# EAGLE design 503_outin_ichigojam (EAGLE 9.6.2)
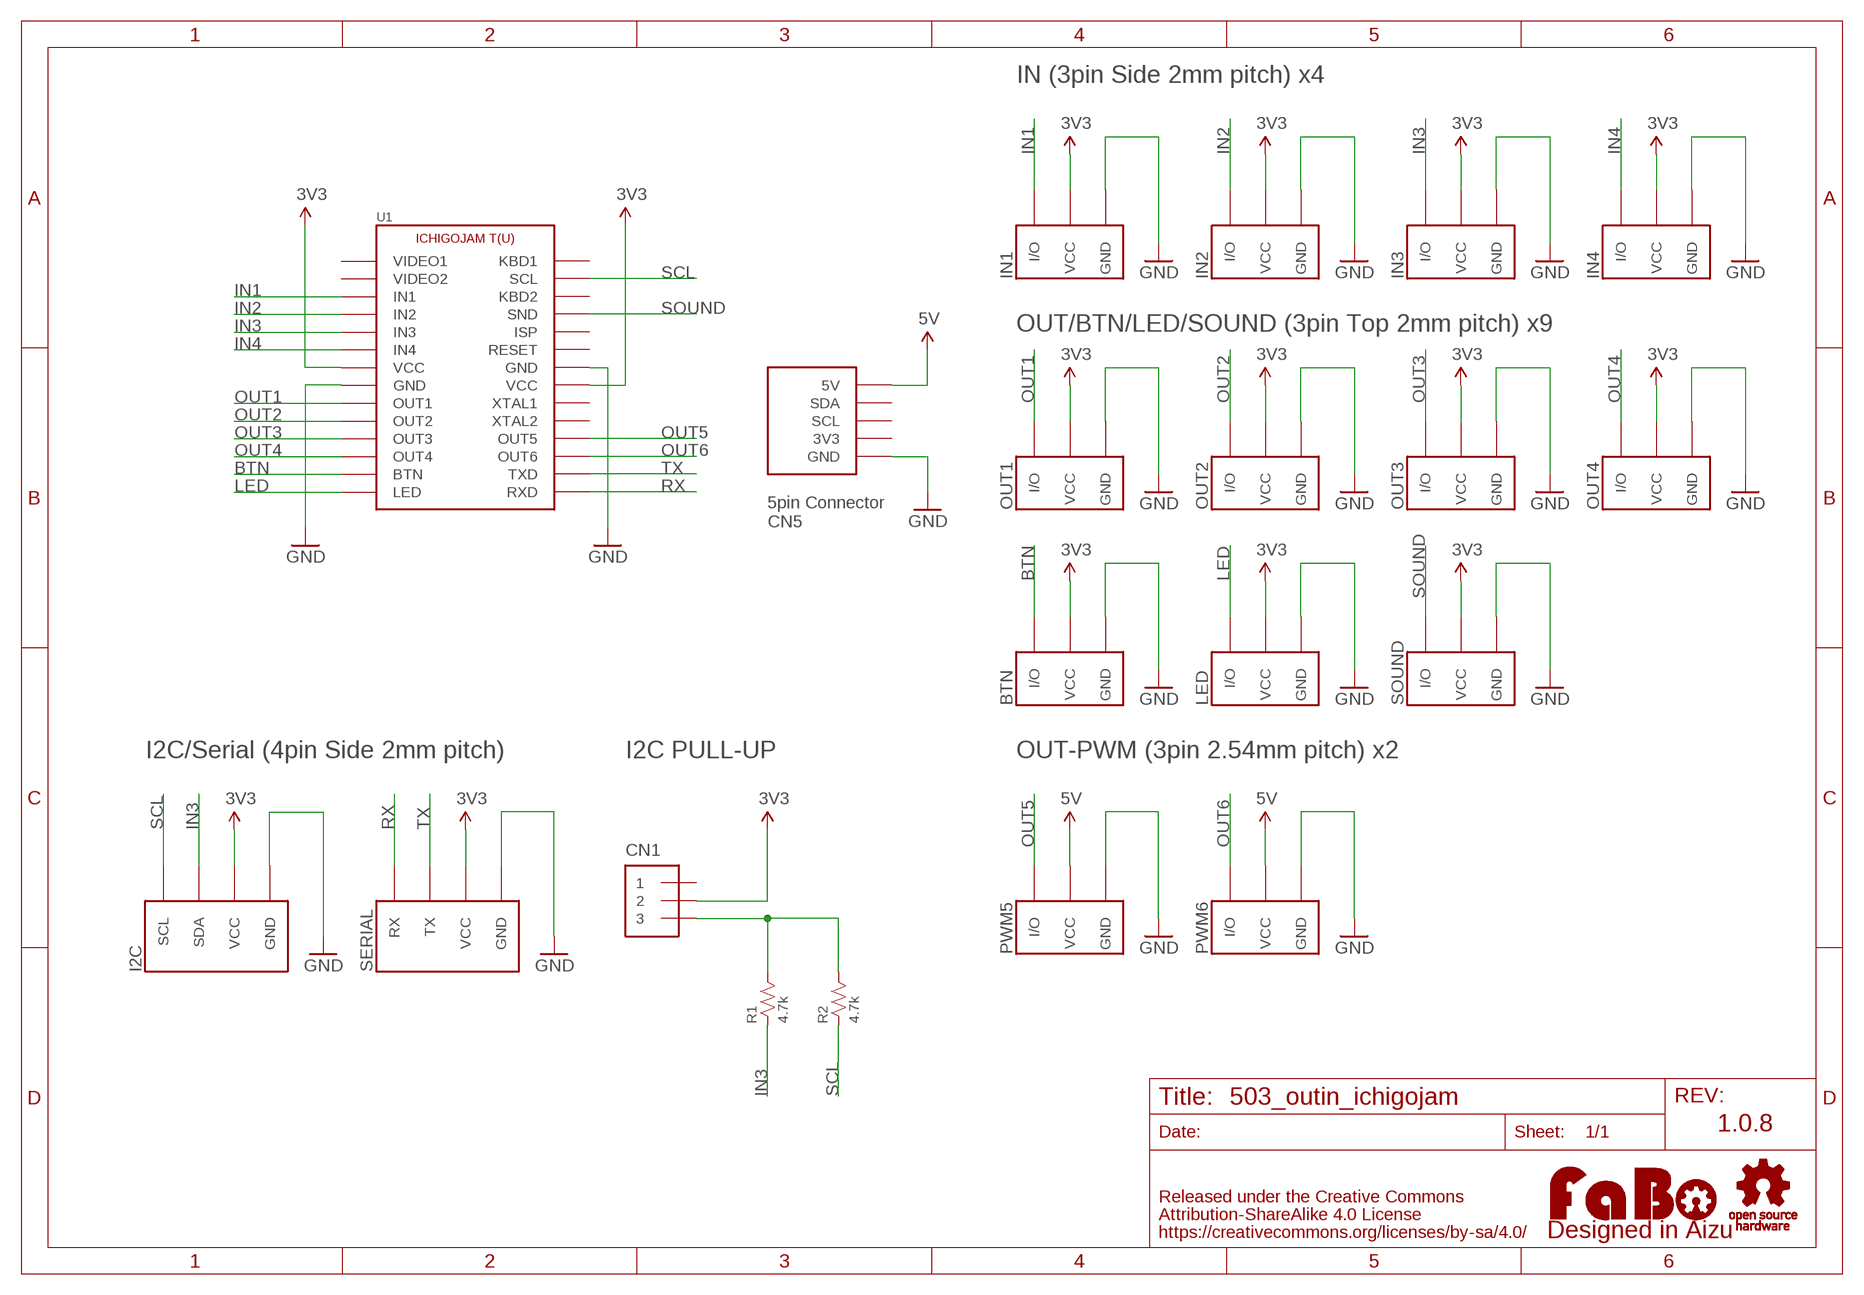
[diagram p0: schematic, sheet 1]

## Parts
BTN  FABO_BRICK_3PIN-B03B-PASK-1  [FABO_BRICK_3PIN_B03B-PASK-1]
CN1  PIN_HEADER_1X3  [PIN_1X3]
I2C  FABO_BRICK_I2C-S04B-PASK-2_LONG  [FABO_BRICK_I2C_S04B-PASK-2_LONG]
IN1  FABO_BRICK_3PIN-S03B-PASK-2_LONG  [FABO_BRICK_3PIN_S03B-PASK-2_LONG]
IN2  FABO_BRICK_3PIN-S03B-PASK-2_LONG  [FABO_BRICK_3PIN_S03B-PASK-2_LONG]
IN3  FABO_BRICK_3PIN-S03B-PASK-2_LONG  [FABO_BRICK_3PIN_S03B-PASK-2_LONG]
IN4  FABO_BRICK_3PIN-S03B-PASK-2_LONG  [FABO_BRICK_3PIN_S03B-PASK-2_LONG]
LED  FABO_BRICK_3PIN-B03B-PASK-1  [FABO_BRICK_3PIN_B03B-PASK-1]
LOGO1  LOGO_FABO-M  [LOGO_FABO_M]
OUT1  FABO_BRICK_3PIN-B03B-PASK-1  [FABO_BRICK_3PIN_B03B-PASK-1]
OUT2  FABO_BRICK_3PIN-B03B-PASK-1  [FABO_BRICK_3PIN_B03B-PASK-1]
OUT3  FABO_BRICK_3PIN-B03B-PASK-1  [FABO_BRICK_3PIN_B03B-PASK-1]
OUT4  FABO_BRICK_3PIN-B03B-PASK-1  [FABO_BRICK_3PIN_B03B-PASK-1]
PWM5  FABO_BRICK_3PIN-HEADER  [FABO_BRICK_3PIN_HEADER]
PWM6  FABO_BRICK_3PIN-HEADER  [FABO_BRICK_3PIN_HEADER]
R1  4.7k  RESISTOR-AXL-REGULAR  [AXL-REGULAR]
R2  4.7k  RESISTOR-AXL-REGULAR  [AXL-REGULAR]
SERIAL  FABO_BRICK_SERIAL-S04B-PASK-2_LONG  [FABO_BRICK_SERIAL_S04B-PASK-2_LONG]
SOUND  FABO_BRICK_3PIN-B03B-PASK-1  [FABO_BRICK_3PIN_B03B-PASK-1]
U1  ICHIGOJAM_T-NOLABEL  [ICHIGOJAM_T_NOLABEL]
U$2  LOGO_OSHW-M_BOTTOM  [LOGO_OSHW_M_BOTTOM]

## Nets
3V3: BTN.VCC CN1.2 I2C.VCC IN1.VCC IN2.VCC IN3.VCC IN4.VCC LED.VCC OUT1.VCC OUT2.VCC OUT3.VCC OUT4.VCC SERIAL.VCC SOUND.VCC U1.VCC1(VCC) U1.VCC2(VCC)
5V: PWM5.VCC PWM6.VCC U1.5V
BTN: BTN.I/O U1.BTN
GND: BTN.GND I2C.GND IN1.GND IN2.GND IN3.GND IN4.GND LED.GND OUT1.GND OUT2.GND OUT3.GND OUT4.GND PWM5.GND PWM6.GND SERIAL.GND SOUND.GND U1.GND1(GND) U1.GND2(GND) U1.GND3(GND)
IN1: IN1.I/O U1.IN1
IN2: IN2.I/O U1.IN2
IN3: I2C.SDA IN3.I/O R1.1 U1.IN3
IN4: IN4.I/O U1.IN4
LED: LED.I/O U1.LED
N$1: CN1.3 R1.2 R2.2
OUT1: OUT1.I/O U1.OUT1
OUT2: OUT2.I/O U1.OUT2
OUT3: OUT3.I/O U1.OUT3
OUT4: OUT4.I/O U1.OUT4
OUT5: PWM5.I/O U1.OUT5
OUT6: PWM6.I/O U1.OUT6
RX: SERIAL.RX U1.RXD
SCL: I2C.SCL R2.1 U1.SCL1(SCL)
SOUND: SOUND.I/O U1.SND
TX: SERIAL.TX U1.TXD
Unconnected: CN1.1 U1.3V3 U1.ISP U1.KBD1 U1.KBD2 U1.RST(RESET) U1.SCL2(SCL) U1.SDA U1.VIDEO1 U1.VIDEO2 U1.XTAL1 U1.XTAL2

## Notes on the sheet
- IN (3pin Side 2mm pitch) x4
- OUT/BTN/LED/SOUND (3pin Top 2mm pitch) x9
- 5pin Connector
  CN5
- I2C/Serial (4pin Side 2mm pitch) | I2C PULL-UP | OUT-PWM (3pin 2.54mm pitch) x2
- 1.0.8

## Library data of the parts
BTN IN1-IN4 LED OUT1-OUT4 PWM5 PWM6 SOUND = FaBo-Template:FABO_BRICK_3PIN: FaBo Brick 3pin
CN1 = FaBo-PIN:PIN_HEADER_1X3
I2C = FaBo-Template:FABO_BRICK_I2C: FaBo Brick I2C
LOGO1 = component:LOGO_FABO
R1 R2 = FaBo-Resistors:RESISTOR: RESISTOR
SERIAL = FaBo-Template:FABO_BRICK_SERIAL: FaBo Brick Serial
U1 = FaBo-Boards:ICHIGOJAM_T
U$2 = FaBo-etc:LOGO_OSHW

## Board
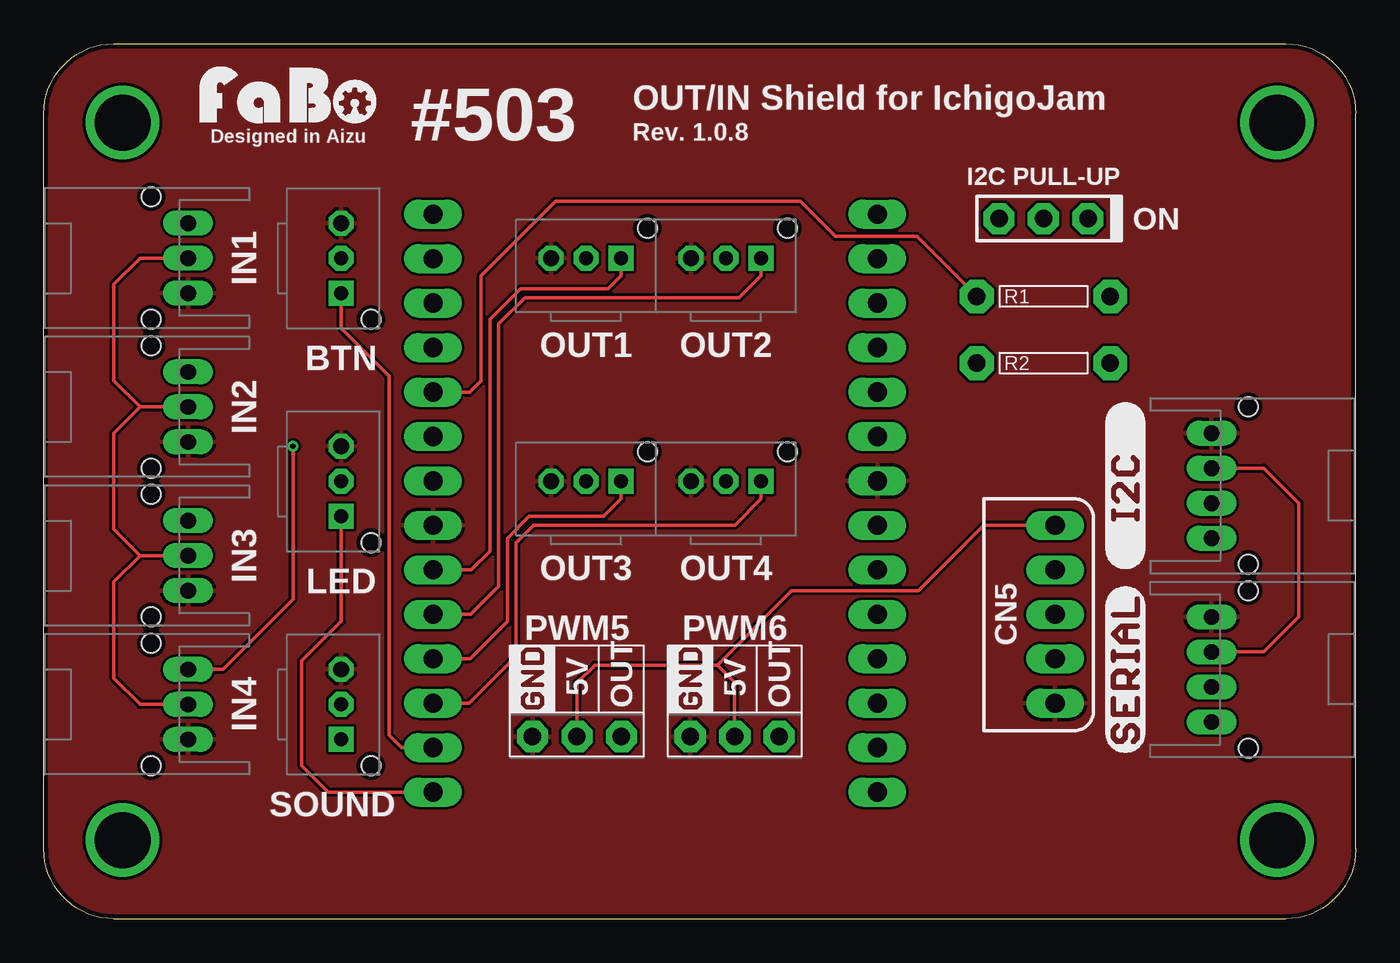
[diagram p1: board, top side]
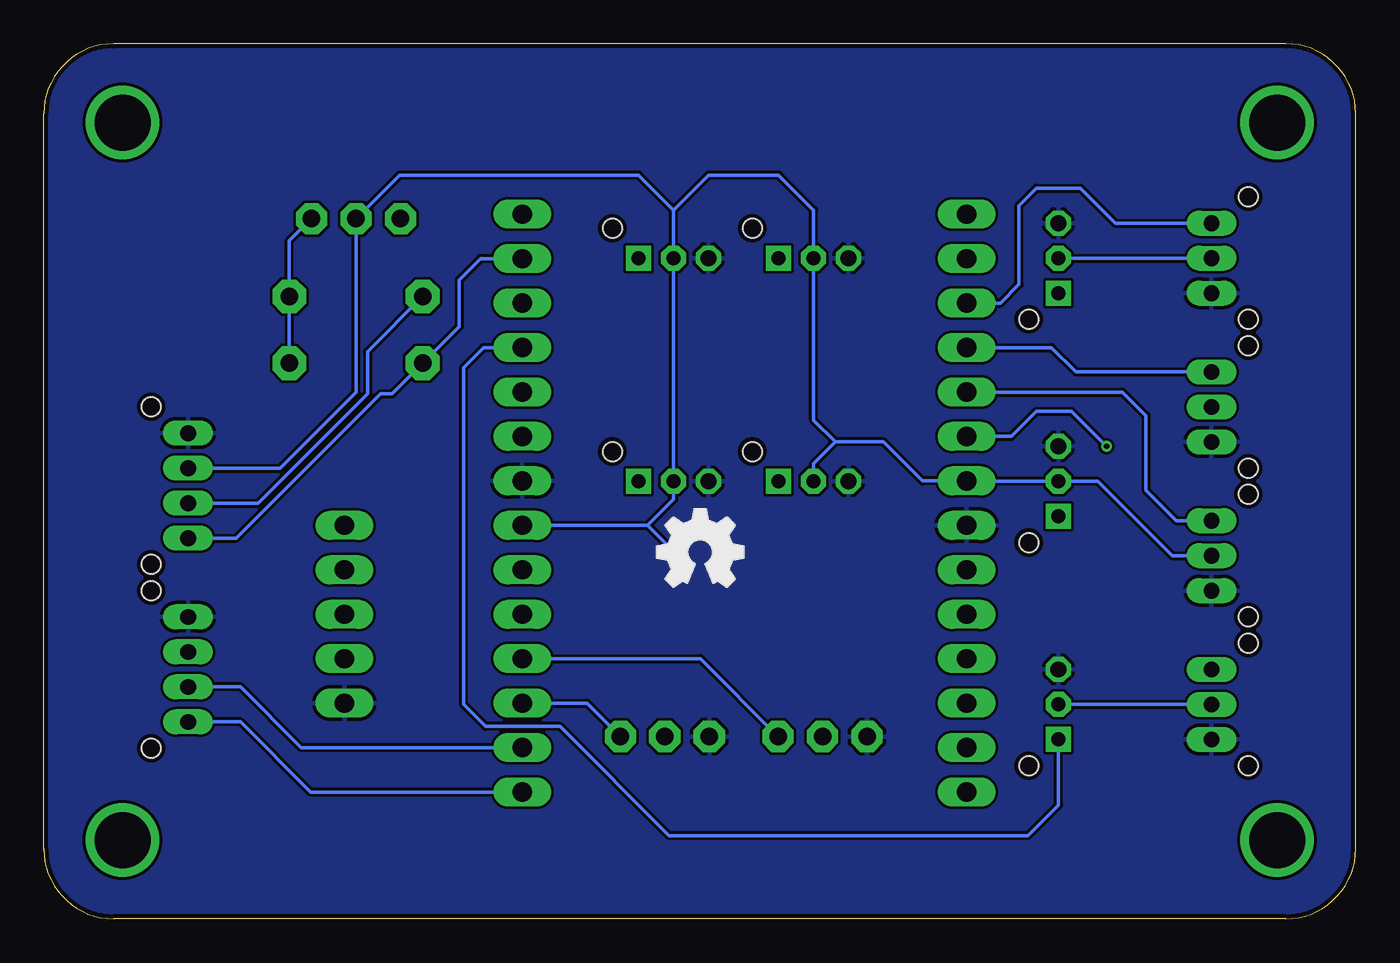
[diagram p2: board, bottom side, seen from below]

Size 75 x 50 mm. Coordinates in mm from the lower left corner, seen from the top.
Copper layers (1*16): Top 0.035mm / dielectric 1.6mm / Bottom 0.035mm
Design rules "PCBway": minimum track width 6mil, minimum drill 12mil, track to track 6mil, track to pad 6mil, pad to pad 6mil, via to via 6mil, smd to smd 6mil, copper to edge 10mil, drill to drill 10mil, minimum pad ring 10mil, minimum via ring 6mil, stop-mask expansion 2mil, vias tented up to drill 100mil, thermal gap 8mil

### Footprints (pad centres in the part's own frame; a part is rotated, then mirrored left to right if it is on the bottom)
FABO_BRICK_3PIN_B03B-PASK-1 = drill 0.9 pad 1.422 octagon: GND -2,0 | drill 0.8 pad 1.422 square: I/O 2,0 | drill 0.8 pad 1.422 octagon: VCC 0,0 | hole 1.1: 3.5,1.7
PIN_1X3 = drill 1 pad 1.778 octagon: 1 -2.54,0; 2 0,0; 3 2.54,0
FABO_BRICK_I2C_S04B-PASK-2_LONG = drill 0.9 pad 1.422 long: GND -3,0; SCL 3,0; SDA 1,0; VCC -1,0 | hole 1.1: 4.5,2.1; -4.5,2.1
FABO_BRICK_3PIN_S03B-PASK-2_LONG = drill 0.9 pad 1.422 long: GND -2,0; I/O 2,0; VCC 0,0 | hole 1.1: 3.5,2.1; -3.5,2.1
FABO_BRICK_3PIN_HEADER = drill 1 pad 1.778 octagon: GND -2.54,0; I/O 2.54,0; VCC 0,0
AXL-REGULAR = drill 1 pad 1.93 octagon: 1 -3.81,0; 2 3.81,0
FABO_BRICK_SERIAL_S04B-PASK-2_LONG = drill 0.9 pad 1.422 long: GND -3,0; RX 3,0; TX 1,0; VCC -1,0 | hole 1.1: 4.5,2.1; -4.5,2.1
ICHIGOJAM_T_NOLABEL = drill 1.1 long: 3V3 57.81,14.86; 5V 57.81,22.48; BTN 22.25,9.78; GND1 22.25,22.48; GND2 47.65,25.02; GND3 57.81,12.32; IN1 22.25,35.18; IN2 22.25,32.64; IN3 22.25,30.1; IN4 22.25,27.56; ISP 47.65,30.1; KBD1 47.65,40.26; KBD2 47.65,35.18; LED 22.25,7.24; OUT1 22.25,19.94; OUT2 22.25,17.4; OUT3 22.25,14.86; OUT4 22.25,12.32; OUT5 47.65,14.86; OUT6 47.65,12.32; RST 47.65,27.56; RXD 47.65,7.24; SCL1 47.65,37.72; SCL2 57.81,17.4; SDA 57.81,19.94; SND 47.65,32.64; TXD 47.65,9.78; VCC1 22.25,25.02; VCC2 47.65,22.48; VIDEO1 22.25,40.26; VIDEO2 22.25,37.72; XTAL1 47.65,19.94; XTAL2 47.65,17.4 | drill 3.2: P$1 4.5,45.5; P$2 70.5,45.5; P$3 70.5,4.5; P$4 4.5,4.5

### Placement (x,y rotation side)
BTN  17,37.75 270 top
CN1  57.15,40.01 0 top
I2C  66.75,24.75 270 top
IN1  8.25,37.75 90 top
IN2  8.25,29.25 90 top
IN3  8.25,20.75 90 top
IN4  8.25,12.25 90 top
LED  17,25 270 top
LOGO1  13.97,45.09 0 top
OUT1  31,37.75 0 top
OUT2  39,37.75 0 top
OUT3  31,25 0 top
OUT4  39,25 0 top
PWM5  30.48,10.41 0 top
PWM6  39.5,10.41 0 top
R1  57.15,35.56 0 top
R2  57.15,31.75 0 top
SERIAL  66.75,14.25 270 top
SOUND  17,12.25 270 top
U1  0,0 0 top
U$2  37.47,20.95 0 top
U$4  [LOGO_SILK_I2C]  63,24.75 90 top
U$5  [LOGO_SILK_SERIAL2]  63,14.25 90 top
U$7  [LOGO_SILK_GND]  29.21,11.81 90 top
U$8  [LOGO_SILK_GND]  38.23,11.81 90 top

### Tracks (layer width: path | path; a pad name or v marks a point on that pad's centre or on a via)
3V3
  Top 0.203: IN1.VCC 5.5,37.75 4,36.25 4,30.75 5.5,29.25 | 5.5,29.25 IN2.VCC | IN3.VCC 5.5,20.75 | 5.5,20.75 4,22.25 4,27.75 5.5,29.25 | IN4.VCC 5.5,12.25 4,13.75 4,19.25 5.5,20.75 | I2C.VCC 69.75,25.75 71.75,23.75 71.75,17.25 69.75,15.25 SERIAL.VCC
  Bottom 0.203: IN3.VCC 10.5,20.75 14.75,25 LED.VCC 22.23,25 U1.VCC1 24.77,25.02 27,27.25 29.75,27.25 | 29.75,27.25 31,28.5 OUT1.VCC 31,40.5 33,42.5 37,42.5 39,40.5 | OUT3.VCC 31,26 29.75,27.25 | U1.VCC2 40.48,22.48 | 40.48,22.48 39,21 | 40.48,22.48 39,23.96 OUT4.VCC OUT2.VCC 39,40.5 | 39,40.5 41,42.5 54.66,42.5 CN1.2 57.15,30.1 61.5,25.75 I2C.VCC | BTN.VCC IN1.VCC | SOUND.VCC IN4.VCC
5V
  Top 0.203: 38.5,14.5 31.5,14.5 30.48,13.48 PWM5.VCC | U1.5V 53.73,22.48 50,18.75 42.75,18.75 38.5,14.5 | PWM6.VCC 39.5,13.5 38.5,14.5
BTN
  Top 0.203: U1.BTN 20.47,9.78 19.75,10.5 19.75,31 17,33.75 BTN.I/O
GND
  pour Bottom: 0,0 75,0 75,50 0,50
  pour Top: 0,0 75,0 75,50 0,50
IN1
  Bottom 0.203: U1.IN1 20.32,35.18 19.25,36.25 19.25,40.75 18.25,41.75 15.75,41.75 13.75,39.75 IN1.I/O
IN2
  Bottom 0.203: U1.IN2 17.39,32.64 16,31.25 IN2.I/O
IN3
  Top 0.203: U1.IN3 24.35,30.1 25,30.75 25,36.75 29.25,41 43.25,41 45.25,39 49.9,39 R1.1
  Bottom 0.203: I2C.SDA 62.75,23.75 56.5,30 56.5,32.4 R1.1 | U1.IN3 13.35,30.1 12,28.75 12,24.5 10.25,22.75 IN3.I/O
IN4  (via drill 0.3)
  Top 0.203: IN4.I/O 10.25,14.25 14.25,18.25 v14.25,27
  Bottom 0.203: U1.IN4 19.69,27.56 18.25,29 16.25,29 v14.25,27
LED
  Top 0.203: U1.LED 16.26,7.24 14.75,8.75 14.75,14.75 17,17 LED.I/O
N$1
  Bottom 0.203: CN1.3 60.96,38.73 R1.2 R2.2
OUT1
  Top 0.203: U1.OUT1 24.44,19.94 25.5,21 25.5,34.25 27.25,36 32.25,36 33,36.75 OUT1.I/O
OUT2
  Top 0.203: OUT2.I/O 41,36.75 39.75,35.5 27.5,35.5 26,34 26,19 24.4,17.4 U1.OUT2
OUT3
  Top 0.203: OUT3.I/O 33,24 32,23 27.75,23 26.5,21.75 26.5,17 24.36,14.86 U1.OUT3
OUT4
  Top 0.203: U1.OUT4 24.32,12.32 27,15 27,21.5 28,22.5 39.5,22.5 41,24 OUT4.I/O
OUT5
  Bottom 0.203: U1.OUT5 37.47,14.86 PWM5.I/O
OUT6
  Bottom 0.203: U1.OUT6 43.94,12.32 PWM6.I/O
RX
  Bottom 0.203: U1.RXD 59.74,7.24 63.75,11.25 SERIAL.RX
SCL
  Bottom 0.203: I2C.SCL 64,21.75 55.75,30 55.09,30 R2.1 51.25,33.84 51.25,36.5 50.03,37.72 U1.SCL1
SOUND
  Bottom 0.203: U1.SND 49.86,32.64 51,31.5 51,12.25 49.75,11 45.5,11 39.25,4.75 18.75,4.75 17,6.5 SOUND.I/O
TX
  Bottom 0.203: U1.TXD 60.28,9.78 63.75,13.25 SERIAL.TX

### Text on the board
tPlace: OUT/IN Shield for IchigoJam | Designed in Aizu | #503 | Rev. 1.0.8 | I2C PULL-UP | ON | CN5 | 5V | OUT | OUT | 5V